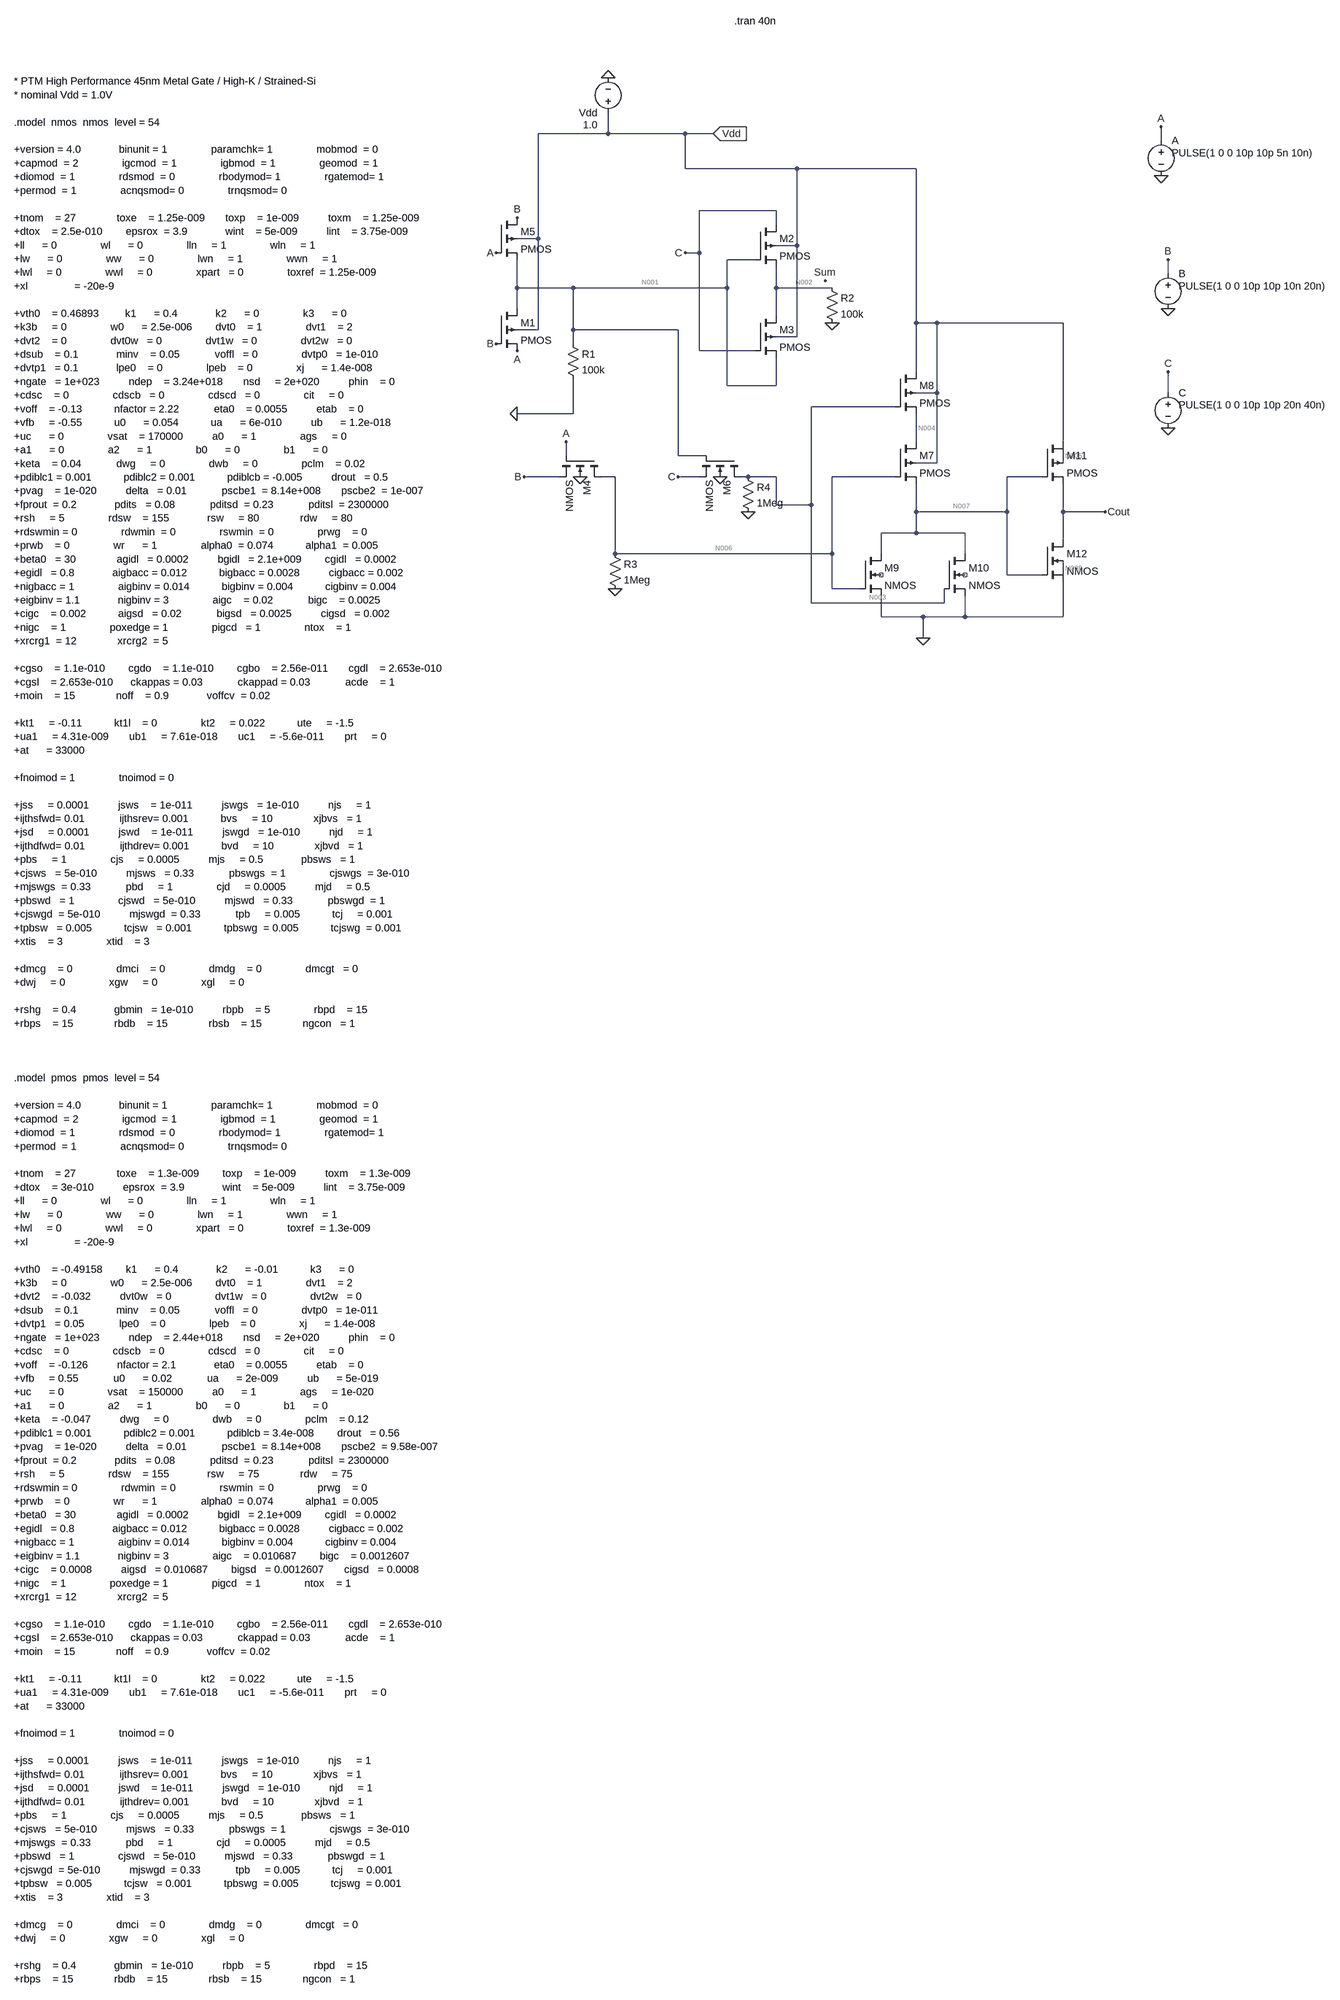
[diagram p0: schematic XA12T_45nm - Copy.asc]
XA12T_45nm - Copy.asc, the LTspice schematic file:
Version 4
SHEET 1 1060 3520
WIRE -640 -240 -640 -288
WIRE -640 -240 -800 -240
WIRE -464 -240 -640 -240
WIRE -400 -240 -464 -240
WIRE 624 -224 624 -256
WIRE -464 -160 -464 -240
WIRE -208 -160 -464 -160
WIRE 64 -160 -208 -160
WIRE -256 -64 -432 -64
WIRE -256 -32 -256 -64
WIRE -800 0 -800 -240
WIRE -800 0 -848 0
WIRE -208 16 -208 -160
WIRE -208 16 -256 16
WIRE -432 32 -432 -64
WIRE -432 32 -464 32
WIRE -304 48 -368 48
WIRE 640 80 640 48
WIRE -848 112 -848 48
WIRE -720 112 -848 112
WIRE -368 112 -368 48
WIRE -368 112 -720 112
WIRE -256 112 -256 64
WIRE -128 112 -256 112
WIRE -848 160 -848 112
WIRE -256 176 -256 112
WIRE 64 192 64 -160
WIRE 112 192 64 192
WIRE 400 192 112 192
WIRE -800 208 -800 0
WIRE -800 208 -848 208
WIRE -720 208 -720 112
WIRE -480 208 -720 208
WIRE -208 224 -208 16
WIRE -208 224 -256 224
WIRE -720 240 -720 208
WIRE -432 256 -432 32
WIRE -304 256 -432 256
WIRE 64 304 64 192
WIRE -368 336 -368 112
WIRE -256 336 -256 272
WIRE -256 336 -368 336
WIRE 112 352 112 192
WIRE 112 352 64 352
WIRE 640 352 640 304
WIRE 16 384 -176 384
WIRE -720 400 -720 320
WIRE -720 400 -848 400
WIRE 64 464 64 400
WIRE 400 464 400 192
WIRE -736 496 -736 464
WIRE -480 496 -480 208
WIRE -416 496 -480 496
WIRE 112 512 112 352
WIRE 112 512 64 512
WIRE 400 512 400 480
WIRE -752 544 -832 544
WIRE -624 544 -656 544
WIRE -432 544 -480 544
WIRE -320 544 -336 544
WIRE -256 544 -320 544
WIRE 16 544 -128 544
WIRE 352 544 272 544
WIRE -256 608 -256 544
WIRE -176 608 -176 384
WIRE -176 608 -256 608
WIRE 64 624 64 560
WIRE 272 624 272 544
WIRE 272 624 64 624
WIRE 400 624 400 560
WIRE 496 624 400 624
WIRE 64 672 64 624
WIRE 64 672 -16 672
WIRE 176 672 64 672
WIRE 400 688 400 624
WIRE -624 720 -624 544
WIRE -128 720 -128 544
WIRE -128 720 -624 720
WIRE -16 720 -16 672
WIRE 176 720 176 672
WIRE 272 768 272 624
WIRE 352 768 272 768
WIRE 400 768 400 736
WIRE -128 800 -128 720
WIRE -64 800 -128 800
WIRE -176 832 -176 608
WIRE 128 832 128 800
WIRE 128 832 -176 832
WIRE -16 864 -16 816
WIRE 80 864 -16 864
WIRE 176 864 176 816
WIRE 176 864 80 864
WIRE 400 864 400 784
WIRE 400 864 176 864
WIRE 80 912 80 864
FLAG 624 -144 0
FLAG 640 160 0
FLAG 640 432 0
FLAG 624 -256 A
FLAG 640 48 B
FLAG 640 304 C
FLAG -400 -240 Vdd
IOPIN -400 -240 In
FLAG -640 -368 0
FLAG -896 32 A
FLAG -848 256 A
FLAG -896 240 B
FLAG -848 -48 B
FLAG -848 400 0
FLAG -704 544 0
FLAG -384 544 0
FLAG -832 544 B
FLAG -736 464 A
FLAG -464 32 C
FLAG -128 192 0
FLAG -480 544 C
FLAG 80 912 0
FLAG 496 624 Cout
FLAG -144 96 Sum
FLAG -624 800 0
FLAG -320 624 0
SYMBOL voltage 624 -240 R0
WINDOW 3 24 44 Left 2
WINDOW 123 0 0 Left 0
WINDOW 39 0 0 Left 0
SYMATTR Value PULSE(1 0 0 10p 10p 5n 10n)
SYMATTR InstName A
SYMBOL voltage 640 64 R0
WINDOW 3 24 44 Left 2
WINDOW 123 0 0 Left 0
WINDOW 39 0 0 Left 0
SYMATTR Value PULSE(1 0 0 10p 10p 10n 20n)
SYMATTR InstName B
SYMBOL voltage 640 336 R0
WINDOW 3 24 44 Left 2
WINDOW 123 0 0 Left 0
WINDOW 39 0 0 Left 0
SYMATTR Value PULSE(1 0 0 10p 10p 20n 40n)
SYMATTR InstName C
SYMBOL voltage -640 -272 R180
WINDOW 3 24 -12 Left 2
WINDOW 123 0 0 Left 0
WINDOW 39 0 0 Left 0
SYMATTR Value 1.0
SYMATTR InstName Vdd
SYMBOL pmos4 -896 -48 R0
SYMATTR InstName M5
SYMATTR Value2 l=45n w=180n
SYMBOL pmos4 -896 160 R0
SYMATTR InstName M1
SYMATTR Value2 l=45n w=180n
SYMBOL pmos4 -304 -32 R0
SYMATTR InstName M2
SYMATTR Value2 l=45n w=180n
SYMBOL pmos4 -304 176 R0
SYMATTR InstName M3
SYMATTR Value2 l=45n w=180n
SYMBOL nmos4 -656 496 R90
SYMATTR InstName M4
SYMATTR Value2 l=45n w=90n
SYMBOL nmos4 -336 496 R90
SYMATTR InstName M6
SYMATTR Value2 l=45n w=90n
SYMBOL res -144 96 R0
SYMATTR InstName R2
SYMATTR Value 100k
SYMBOL pmos4 16 464 R0
SYMATTR InstName M7
SYMATTR Value2 l=45n w=180n
SYMBOL pmos4 16 304 R0
SYMATTR InstName M8
SYMATTR Value2 l=45n w=180n
SYMBOL nmos4 -64 720 R0
SYMATTR InstName M9
SYMATTR Value2 l=45n w=90n
SYMBOL nmos4 128 720 R0
SYMATTR InstName M10
SYMATTR Value2 l=45n w=90n
SYMBOL pmos4 352 464 R0
SYMATTR InstName M11
SYMATTR Value2 l=45n w=180n
SYMBOL nmos4 352 688 R0
SYMATTR InstName M12
SYMATTR Value2 l=45n w=90n
SYMBOL res -640 704 R0
SYMATTR InstName R3
SYMATTR Value 1Meg
SYMBOL res -336 528 R0
SYMATTR InstName R4
SYMATTR Value 1Meg
SYMBOL res -736 224 R0
SYMATTR InstName R1
SYMATTR Value 100k
TEXT -352 -528 Left 2 !.tran 40n
TEXT -2040 -360 Left 2 !* PTM High Performance 45nm Metal Gate / High-K / Strained-Si\n* nominal Vdd = 1.0V\n \n.model  nmos  nmos  level = 54\n \n+version = 4.0             binunit = 1               paramchk= 1               mobmod  = 0             \n+capmod  = 2               igcmod  = 1               igbmod  = 1               geomod  = 1             \n+diomod  = 1               rdsmod  = 0               rbodymod= 1               rgatemod= 1             \n+permod  = 1               acnqsmod= 0               trnqsmod= 0             \n \n+tnom    = 27              toxe    = 1.25e-009       toxp    = 1e-009          toxm    = 1.25e-009     \n+dtox    = 2.5e-010        epsrox  = 3.9             wint    = 5e-009          lint    = 3.75e-009     \n+ll      = 0               wl      = 0               lln     = 1               wln     = 1             \n+lw      = 0               ww      = 0               lwn     = 1               wwn     = 1             \n+lwl     = 0               wwl     = 0               xpart   = 0               toxref  = 1.25e-009     \n+xl                = -20e-9\n \n+vth0    = 0.46893         k1      = 0.4             k2      = 0               k3      = 0             \n+k3b     = 0               w0      = 2.5e-006        dvt0    = 1               dvt1    = 2             \n+dvt2    = 0               dvt0w   = 0               dvt1w   = 0               dvt2w   = 0             \n+dsub    = 0.1             minv    = 0.05            voffl   = 0               dvtp0   = 1e-010        \n+dvtp1   = 0.1             lpe0    = 0               lpeb    = 0               xj      = 1.4e-008      \n+ngate   = 1e+023          ndep    = 3.24e+018       nsd     = 2e+020          phin    = 0             \n+cdsc    = 0               cdscb   = 0               cdscd   = 0               cit     = 0             \n+voff    = -0.13           nfactor = 2.22            eta0    = 0.0055          etab    = 0             \n+vfb     = -0.55           u0      = 0.054           ua      = 6e-010          ub      = 1.2e-018      \n+uc      = 0               vsat    = 170000          a0      = 1               ags     = 0             \n+a1      = 0               a2      = 1               b0      = 0               b1      = 0             \n+keta    = 0.04            dwg     = 0               dwb     = 0               pclm    = 0.02          \n+pdiblc1 = 0.001           pdiblc2 = 0.001           pdiblcb = -0.005          drout   = 0.5           \n+pvag    = 1e-020          delta   = 0.01            pscbe1  = 8.14e+008       pscbe2  = 1e-007        \n+fprout  = 0.2             pdits   = 0.08            pditsd  = 0.23            pditsl  = 2300000       \n+rsh     = 5               rdsw    = 155             rsw     = 80              rdw     = 80            \n+rdswmin = 0               rdwmin  = 0               rswmin  = 0               prwg    = 0             \n+prwb    = 0               wr      = 1               alpha0  = 0.074           alpha1  = 0.005         \n+beta0   = 30              agidl   = 0.0002          bgidl   = 2.1e+009        cgidl   = 0.0002        \n+egidl   = 0.8             aigbacc = 0.012           bigbacc = 0.0028          cigbacc = 0.002         \n+nigbacc = 1               aigbinv = 0.014           bigbinv = 0.004           cigbinv = 0.004         \n+eigbinv = 1.1             nigbinv = 3               aigc    = 0.02            bigc    = 0.0025        \n+cigc    = 0.002           aigsd   = 0.02            bigsd   = 0.0025          cigsd   = 0.002         \n+nigc    = 1               poxedge = 1               pigcd   = 1               ntox    = 1             \n+xrcrg1  = 12              xrcrg2  = 5             \n \n+cgso    = 1.1e-010        cgdo    = 1.1e-010        cgbo    = 2.56e-011       cgdl    = 2.653e-010    \n+cgsl    = 2.653e-010      ckappas = 0.03            ckappad = 0.03            acde    = 1             \n+moin    = 15              noff    = 0.9             voffcv  = 0.02          \n \n+kt1     = -0.11           kt1l    = 0               kt2     = 0.022           ute     = -1.5          \n+ua1     = 4.31e-009       ub1     = 7.61e-018       uc1     = -5.6e-011       prt     = 0             \n+at      = 33000         \n \n+fnoimod = 1               tnoimod = 0             \n \n+jss     = 0.0001          jsws    = 1e-011          jswgs   = 1e-010          njs     = 1             \n+ijthsfwd= 0.01            ijthsrev= 0.001           bvs     = 10              xjbvs   = 1             \n+jsd     = 0.0001          jswd    = 1e-011          jswgd   = 1e-010          njd     = 1             \n+ijthdfwd= 0.01            ijthdrev= 0.001           bvd     = 10              xjbvd   = 1             \n+pbs     = 1               cjs     = 0.0005          mjs     = 0.5             pbsws   = 1             \n+cjsws   = 5e-010          mjsws   = 0.33            pbswgs  = 1               cjswgs  = 3e-010        \n+mjswgs  = 0.33            pbd     = 1               cjd     = 0.0005          mjd     = 0.5           \n+pbswd   = 1               cjswd   = 5e-010          mjswd   = 0.33            pbswgd  = 1             \n+cjswgd  = 5e-010          mjswgd  = 0.33            tpb     = 0.005           tcj     = 0.001         \n+tpbsw   = 0.005           tcjsw   = 0.001           tpbswg  = 0.005           tcjswg  = 0.001         \n+xtis    = 3               xtid    = 3             \n \n+dmcg    = 0               dmci    = 0               dmdg    = 0               dmcgt   = 0             \n+dwj     = 0               xgw     = 0               xgl     = 0             \n \n+rshg    = 0.4             gbmin   = 1e-010          rbpb    = 5               rbpd    = 15            \n+rbps    = 15              rbdb    = 15              rbsb    = 15              ngcon   = 1             \n \n\n \n.model  pmos  pmos  level = 54\n \n+version = 4.0             binunit = 1               paramchk= 1               mobmod  = 0             \n+capmod  = 2               igcmod  = 1               igbmod  = 1               geomod  = 1             \n+diomod  = 1               rdsmod  = 0               rbodymod= 1               rgatemod= 1             \n+permod  = 1               acnqsmod= 0               trnqsmod= 0             \n \n+tnom    = 27              toxe    = 1.3e-009        toxp    = 1e-009          toxm    = 1.3e-009      \n+dtox    = 3e-010          epsrox  = 3.9             wint    = 5e-009          lint    = 3.75e-009     \n+ll      = 0               wl      = 0               lln     = 1               wln     = 1             \n+lw      = 0               ww      = 0               lwn     = 1               wwn     = 1             \n+lwl     = 0               wwl     = 0               xpart   = 0               toxref  = 1.3e-009      \n+xl                = -20e-9\n \n+vth0    = -0.49158        k1      = 0.4             k2      = -0.01           k3      = 0             \n+k3b     = 0               w0      = 2.5e-006        dvt0    = 1               dvt1    = 2             \n+dvt2    = -0.032          dvt0w   = 0               dvt1w   = 0               dvt2w   = 0             \n+dsub    = 0.1             minv    = 0.05            voffl   = 0               dvtp0   = 1e-011        \n+dvtp1   = 0.05            lpe0    = 0               lpeb    = 0               xj      = 1.4e-008      \n+ngate   = 1e+023          ndep    = 2.44e+018       nsd     = 2e+020          phin    = 0             \n+cdsc    = 0               cdscb   = 0               cdscd   = 0               cit     = 0             \n+voff    = -0.126          nfactor = 2.1             eta0    = 0.0055          etab    = 0             \n+vfb     = 0.55            u0      = 0.02            ua      = 2e-009          ub      = 5e-019        \n+uc      = 0               vsat    = 150000          a0      = 1               ags     = 1e-020        \n+a1      = 0               a2      = 1               b0      = 0               b1      = 0             \n+keta    = -0.047          dwg     = 0               dwb     = 0               pclm    = 0.12          \n+pdiblc1 = 0.001           pdiblc2 = 0.001           pdiblcb = 3.4e-008        drout   = 0.56          \n+pvag    = 1e-020          delta   = 0.01            pscbe1  = 8.14e+008       pscbe2  = 9.58e-007     \n+fprout  = 0.2             pdits   = 0.08            pditsd  = 0.23            pditsl  = 2300000       \n+rsh     = 5               rdsw    = 155             rsw     = 75              rdw     = 75            \n+rdswmin = 0               rdwmin  = 0               rswmin  = 0               prwg    = 0             \n+prwb    = 0               wr      = 1               alpha0  = 0.074           alpha1  = 0.005         \n+beta0   = 30              agidl   = 0.0002          bgidl   = 2.1e+009        cgidl   = 0.0002        \n+egidl   = 0.8             aigbacc = 0.012           bigbacc = 0.0028          cigbacc = 0.002         \n+nigbacc = 1               aigbinv = 0.014           bigbinv = 0.004           cigbinv = 0.004         \n+eigbinv = 1.1             nigbinv = 3               aigc    = 0.010687        bigc    = 0.0012607     \n+cigc    = 0.0008          aigsd   = 0.010687        bigsd   = 0.0012607       cigsd   = 0.0008        \n+nigc    = 1               poxedge = 1               pigcd   = 1               ntox    = 1             \n+xrcrg1  = 12              xrcrg2  = 5             \n \n+cgso    = 1.1e-010        cgdo    = 1.1e-010        cgbo    = 2.56e-011       cgdl    = 2.653e-010    \n+cgsl    = 2.653e-010      ckappas = 0.03            ckappad = 0.03            acde    = 1             \n+moin    = 15              noff    = 0.9             voffcv  = 0.02          \n \n+kt1     = -0.11           kt1l    = 0               kt2     = 0.022           ute     = -1.5          \n+ua1     = 4.31e-009       ub1     = 7.61e-018       uc1     = -5.6e-011       prt     = 0             \n+at      = 33000         \n \n+fnoimod = 1               tnoimod = 0             \n \n+jss     = 0.0001          jsws    = 1e-011          jswgs   = 1e-010          njs     = 1             \n+ijthsfwd= 0.01            ijthsrev= 0.001           bvs     = 10              xjbvs   = 1             \n+jsd     = 0.0001          jswd    = 1e-011          jswgd   = 1e-010          njd     = 1             \n+ijthdfwd= 0.01            ijthdrev= 0.001           bvd     = 10              xjbvd   = 1             \n+pbs     = 1               cjs     = 0.0005          mjs     = 0.5             pbsws   = 1             \n+cjsws   = 5e-010          mjsws   = 0.33            pbswgs  = 1               cjswgs  = 3e-010        \n+mjswgs  = 0.33            pbd     = 1               cjd     = 0.0005          mjd     = 0.5           \n+pbswd   = 1               cjswd   = 5e-010          mjswd   = 0.33            pbswgd  = 1             \n+cjswgd  = 5e-010          mjswgd  = 0.33            tpb     = 0.005           tcj     = 0.001         \n+tpbsw   = 0.005           tcjsw   = 0.001           tpbswg  = 0.005           tcjswg  = 0.001         \n+xtis    = 3               xtid    = 3             \n \n+dmcg    = 0               dmci    = 0               dmdg    = 0               dmcgt   = 0             \n+dwj     = 0               xgw     = 0               xgl     = 0             \n \n+rshg    = 0.4             gbmin   = 1e-010          rbpb    = 5               rbpd    = 15            \n+rbps    = 15              rbdb    = 15              rbsb    = 15              ngcon   = 1

The netlist it stands for:
* XA12T_45nm - Copy.asc
V§A A 0 PULSE(1 0 0 10p 10p 5n 10n)
V§B B 0 PULSE(1 0 0 10p 10p 10n 20n)
V§C C 0 PULSE(1 0 0 10p 10p 20n 40n)
Vdd Vdd 0 1.0
M5 B A N001 Vdd PMOS l=45n w=180n
M1 N001 B A Vdd PMOS l=45n w=180n
M2 C N001 N002 Vdd PMOS l=45n w=180n
M3 N002 C N001 Vdd PMOS l=45n w=180n
M4 N006 A B 0 NMOS l=45n w=90n
M6 N003 N001 C 0 NMOS l=45n w=90n
R2 N002 0 100k
M7 N004 N006 N007 Vdd PMOS l=45n w=180n
M8 Vdd N003 N004 Vdd PMOS l=45n w=180n
M9 N007 N006 0 NC_01 NMOS l=45n w=90n
M10 N007 N003 0 NC_02 NMOS l=45n w=90n
M11 Vdd N007 Cout N005 PMOS l=45n w=180n
M12 Cout N007 0 N008 NMOS l=45n w=90n
R3 N006 0 1Meg
R4 N003 0 1Meg
R1 N001 0 100k
.model NMOS NMOS
.model PMOS PMOS
.lib standard.mos
.tran 40n
* PTM High Performance 45nm Metal Gate / High-K / Strained-Si
* nominal Vdd = 1.0V
.model  nmos  nmos  level = 54
+version = 4.0             binunit = 1               paramchk= 1               mobmod  = 0
+capmod  = 2               igcmod  = 1               igbmod  = 1               geomod  = 1
+diomod  = 1               rdsmod  = 0               rbodymod= 1               rgatemod= 1
+permod  = 1               acnqsmod= 0               trnqsmod= 0
+tnom    = 27              toxe    = 1.25e-009       toxp    = 1e-009          toxm    = 1.25e-009
+dtox    = 2.5e-010        epsrox  = 3.9             wint    = 5e-009          lint    = 3.75e-009
+ll      = 0               wl      = 0               lln     = 1               wln     = 1
+lw      = 0               ww      = 0               lwn     = 1               wwn     = 1
+lwl     = 0               wwl     = 0               xpart   = 0               toxref  = 1.25e-009
+xl                = -20e-9
+vth0    = 0.46893         k1      = 0.4             k2      = 0               k3      = 0
+k3b     = 0               w0      = 2.5e-006        dvt0    = 1               dvt1    = 2
+dvt2    = 0               dvt0w   = 0               dvt1w   = 0               dvt2w   = 0
+dsub    = 0.1             minv    = 0.05            voffl   = 0               dvtp0   = 1e-010
+dvtp1   = 0.1             lpe0    = 0               lpeb    = 0               xj      = 1.4e-008
+ngate   = 1e+023          ndep    = 3.24e+018       nsd     = 2e+020          phin    = 0
+cdsc    = 0               cdscb   = 0               cdscd   = 0               cit     = 0
+voff    = -0.13           nfactor = 2.22            eta0    = 0.0055          etab    = 0
+vfb     = -0.55           u0      = 0.054           ua      = 6e-010          ub      = 1.2e-018
+uc      = 0               vsat    = 170000          a0      = 1               ags     = 0
+a1      = 0               a2      = 1               b0      = 0               b1      = 0
+keta    = 0.04            dwg     = 0               dwb     = 0               pclm    = 0.02
+pdiblc1 = 0.001           pdiblc2 = 0.001           pdiblcb = -0.005          drout   = 0.5
+pvag    = 1e-020          delta   = 0.01            pscbe1  = 8.14e+008       pscbe2  = 1e-007
+fprout  = 0.2             pdits   = 0.08            pditsd  = 0.23            pditsl  = 2300000
+rsh     = 5               rdsw    = 155             rsw     = 80              rdw     = 80
+rdswmin = 0               rdwmin  = 0               rswmin  = 0               prwg    = 0
+prwb    = 0               wr      = 1               alpha0  = 0.074           alpha1  = 0.005
+beta0   = 30              agidl   = 0.0002          bgidl   = 2.1e+009        cgidl   = 0.0002
+egidl   = 0.8             aigbacc = 0.012           bigbacc = 0.0028          cigbacc = 0.002
+nigbacc = 1               aigbinv = 0.014           bigbinv = 0.004           cigbinv = 0.004
+eigbinv = 1.1             nigbinv = 3               aigc    = 0.02            bigc    = 0.0025
+cigc    = 0.002           aigsd   = 0.02            bigsd   = 0.0025          cigsd   = 0.002
+nigc    = 1               poxedge = 1               pigcd   = 1               ntox    = 1
+xrcrg1  = 12              xrcrg2  = 5
+cgso    = 1.1e-010        cgdo    = 1.1e-010        cgbo    = 2.56e-011       cgdl    = 2.653e-010
+cgsl    = 2.653e-010      ckappas = 0.03            ckappad = 0.03            acde    = 1
+moin    = 15              noff    = 0.9             voffcv  = 0.02
+kt1     = -0.11           kt1l    = 0               kt2     = 0.022           ute     = -1.5
+ua1     = 4.31e-009       ub1     = 7.61e-018       uc1     = -5.6e-011       prt     = 0
+at      = 33000
+fnoimod = 1               tnoimod = 0
+jss     = 0.0001          jsws    = 1e-011          jswgs   = 1e-010          njs     = 1
+ijthsfwd= 0.01            ijthsrev= 0.001           bvs     = 10              xjbvs   = 1
+jsd     = 0.0001          jswd    = 1e-011          jswgd   = 1e-010          njd     = 1
+ijthdfwd= 0.01            ijthdrev= 0.001           bvd     = 10              xjbvd   = 1
+pbs     = 1               cjs     = 0.0005          mjs     = 0.5             pbsws   = 1
+cjsws   = 5e-010          mjsws   = 0.33            pbswgs  = 1               cjswgs  = 3e-010
+mjswgs  = 0.33            pbd     = 1               cjd     = 0.0005          mjd     = 0.5
+pbswd   = 1               cjswd   = 5e-010          mjswd   = 0.33            pbswgd  = 1
+cjswgd  = 5e-010          mjswgd  = 0.33            tpb     = 0.005           tcj     = 0.001
+tpbsw   = 0.005           tcjsw   = 0.001           tpbswg  = 0.005           tcjswg  = 0.001
+xtis    = 3               xtid    = 3
+dmcg    = 0               dmci    = 0               dmdg    = 0               dmcgt   = 0
+dwj     = 0               xgw     = 0               xgl     = 0
+rshg    = 0.4             gbmin   = 1e-010          rbpb    = 5               rbpd    = 15
+rbps    = 15              rbdb    = 15              rbsb    = 15              ngcon   = 1
.model  pmos  pmos  level = 54
+version = 4.0             binunit = 1               paramchk= 1               mobmod  = 0
+capmod  = 2               igcmod  = 1               igbmod  = 1               geomod  = 1
+diomod  = 1               rdsmod  = 0               rbodymod= 1               rgatemod= 1
+permod  = 1               acnqsmod= 0               trnqsmod= 0
+tnom    = 27              toxe    = 1.3e-009        toxp    = 1e-009          toxm    = 1.3e-009
+dtox    = 3e-010          epsrox  = 3.9             wint    = 5e-009          lint    = 3.75e-009
+ll      = 0               wl      = 0               lln     = 1               wln     = 1
+lw      = 0               ww      = 0               lwn     = 1               wwn     = 1
+lwl     = 0               wwl     = 0               xpart   = 0               toxref  = 1.3e-009
+xl                = -20e-9
+vth0    = -0.49158        k1      = 0.4             k2      = -0.01           k3      = 0
+k3b     = 0               w0      = 2.5e-006        dvt0    = 1               dvt1    = 2
+dvt2    = -0.032          dvt0w   = 0               dvt1w   = 0               dvt2w   = 0
+dsub    = 0.1             minv    = 0.05            voffl   = 0               dvtp0   = 1e-011
+dvtp1   = 0.05            lpe0    = 0               lpeb    = 0               xj      = 1.4e-008
+ngate   = 1e+023          ndep    = 2.44e+018       nsd     = 2e+020          phin    = 0
+cdsc    = 0               cdscb   = 0               cdscd   = 0               cit     = 0
+voff    = -0.126          nfactor = 2.1             eta0    = 0.0055          etab    = 0
+vfb     = 0.55            u0      = 0.02            ua      = 2e-009          ub      = 5e-019
+uc      = 0               vsat    = 150000          a0      = 1               ags     = 1e-020
+a1      = 0               a2      = 1               b0      = 0               b1      = 0
+keta    = -0.047          dwg     = 0               dwb     = 0               pclm    = 0.12
+pdiblc1 = 0.001           pdiblc2 = 0.001           pdiblcb = 3.4e-008        drout   = 0.56
+pvag    = 1e-020          delta   = 0.01            pscbe1  = 8.14e+008       pscbe2  = 9.58e-007
+fprout  = 0.2             pdits   = 0.08            pditsd  = 0.23            pditsl  = 2300000
+rsh     = 5               rdsw    = 155             rsw     = 75              rdw     = 75
+rdswmin = 0               rdwmin  = 0               rswmin  = 0               prwg    = 0
+prwb    = 0               wr      = 1               alpha0  = 0.074           alpha1  = 0.005
+beta0   = 30              agidl   = 0.0002          bgidl   = 2.1e+009        cgidl   = 0.0002
+egidl   = 0.8             aigbacc = 0.012           bigbacc = 0.0028          cigbacc = 0.002
+nigbacc = 1               aigbinv = 0.014           bigbinv = 0.004           cigbinv = 0.004
+eigbinv = 1.1             nigbinv = 3               aigc    = 0.010687        bigc    = 0.0012607
+cigc    = 0.0008          aigsd   = 0.010687        bigsd   = 0.0012607       cigsd   = 0.0008
+nigc    = 1               poxedge = 1               pigcd   = 1               ntox    = 1
+xrcrg1  = 12              xrcrg2  = 5
+cgso    = 1.1e-010        cgdo    = 1.1e-010        cgbo    = 2.56e-011       cgdl    = 2.653e-010
+cgsl    = 2.653e-010      ckappas = 0.03            ckappad = 0.03            acde    = 1
+moin    = 15              noff    = 0.9             voffcv  = 0.02
+kt1     = -0.11           kt1l    = 0               kt2     = 0.022           ute     = -1.5
+ua1     = 4.31e-009       ub1     = 7.61e-018       uc1     = -5.6e-011       prt     = 0
+at      = 33000
+fnoimod = 1               tnoimod = 0
+jss     = 0.0001          jsws    = 1e-011          jswgs   = 1e-010          njs     = 1
+ijthsfwd= 0.01            ijthsrev= 0.001           bvs     = 10              xjbvs   = 1
+jsd     = 0.0001          jswd    = 1e-011          jswgd   = 1e-010          njd     = 1
+ijthdfwd= 0.01            ijthdrev= 0.001           bvd     = 10              xjbvd   = 1
+pbs     = 1               cjs     = 0.0005          mjs     = 0.5             pbsws   = 1
+cjsws   = 5e-010          mjsws   = 0.33            pbswgs  = 1               cjswgs  = 3e-010
+mjswgs  = 0.33            pbd     = 1               cjd     = 0.0005          mjd     = 0.5
+pbswd   = 1               cjswd   = 5e-010          mjswd   = 0.33            pbswgd  = 1
+cjswgd  = 5e-010          mjswgd  = 0.33            tpb     = 0.005           tcj     = 0.001
+tpbsw   = 0.005           tcjsw   = 0.001           tpbswg  = 0.005           tcjswg  = 0.001
+xtis    = 3               xtid    = 3
+dmcg    = 0               dmci    = 0               dmdg    = 0               dmcgt   = 0
+dwj     = 0               xgw     = 0               xgl     = 0
+rshg    = 0.4             gbmin   = 1e-010          rbpb    = 5               rbpd    = 15
+rbps    = 15              rbdb    = 15              rbsb    = 15              ngcon   = 1
.backanno
.end

* Results of the author's LTspice run, read from the files saved beside the schematic
* Operating Point, zero values left out:
*   V(a) = 1 V
*   V(b) = 1 V
*   V(c) = 1 V
*   V(vdd) = 1 V
*   V(n001) = 248.9 µV
*   V(n002) = 976.9 mV
*   V(n006) = 572 mV
*   V(n003) = 1.833 mV
*   V(n004) = 981 mV
*   V(n007) = 49.98 mV
*   V(cout) = 999.9 mV
*   V(n005) = 859.2 mV
*   V(n008) = 260.3 mV
*   Id(M12) = 35.38 nA
*   Ig(M12) = -10.36 pA
*   Is(M12) = -35.37 nA
*   Id(M10) = 53.33 pA
*   Is(M10) = -53.29 pA
*   Id(M9) = 8.064 µA
*   Ig(M9) = 1.44 pA
*   Is(M9) = -8.064 µA
*   Id(M6) = -1.582 nA
*   Ig(M6) = -12.79 pA
*   Ib(M6) = -1.003 pA
*   Is(M6) = 1.596 nA
*   Id(M4) = -572 nA
*   Ib(M4) = -1.586 pA
*   Is(M4) = 572 nA
*   Id(M11) = 35.58 nA
*   Ig(M11) = -200 pA
*   Is(M11) = -35.38 nA
*   Id(M8) = 8.064 µA
*   Ig(M8) = -250.2 pA
*   Ib(M8) = 5.371 pA
*   Is(M8) = -8.064 µA
*   Id(M7) = 8.064 µA
*   Ig(M7) = 13.46 pA
*   Ib(M7) = 1.022 pA
*   Is(M7) = -8.064 µA
*   Id(M3) = 307.8 pA
*   Ig(M3) = 124.7 pA
*   Ib(M3) = 1.029 pA
*   Is(M3) = -433.5 pA
*   Id(M2) = 9.77 µA
*   Ig(M2) = -251.3 pA
*   Ib(M2) = 5.584 pA
*   Is(M2) = -9.769 µA
*   Id(M1) = -895.7 pA
*   Ig(M1) = 124.7 pA
*   Ib(M1) = 1.01 pA
*   Is(M1) = 770.1 pA
*   Id(M5) = 770.1 pA
*   Ig(M5) = 124.7 pA
*   Is(M5) = -895.7 pA
*   I(R1) = 2.489 nA
*   I(R4) = 1.833 nA
*   I(R3) = 572 nA
*   I(R2) = 9.769 µA
*   I(Vdd) = -8.1 µA
*   I(C) = -9.771 µA
*   I(B) = -572.9 nA
*   I(A) = -894.9 pA
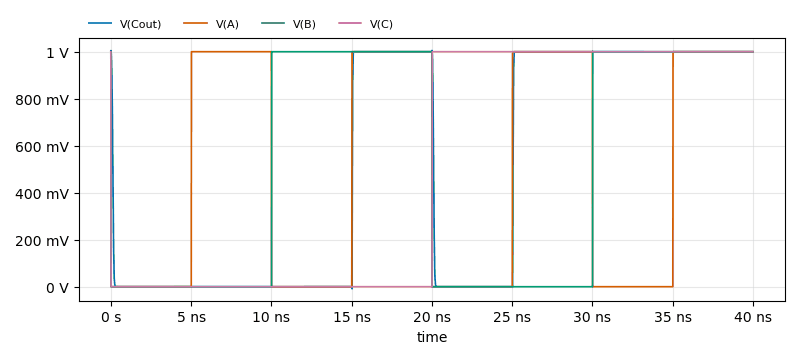
[diagram p1: Transient Analysis of XA12T_45nm - Copy.asc, plotted from the saved traces]
* Transient Analysis, 1 run:
*   V(Cout): min -8.892 mV, max 1.006 V, average 503.1 mV, rms 708.1 mV, last 999.9 mV
*   V(A): min 0 V, max 1 V, average 499 mV, rms 706.2 mV, last 1 V
*   V(B): min 0 V, max 1 V, average 499.5 mV, rms 706.6 mV, last 1 V
*   V(C): min 0 V, max 1 V, average 499.8 mV, rms 706.9 mV, last 1 V